# Altium schematic sheet vesta_IO_buffering.SchDoc
size A3
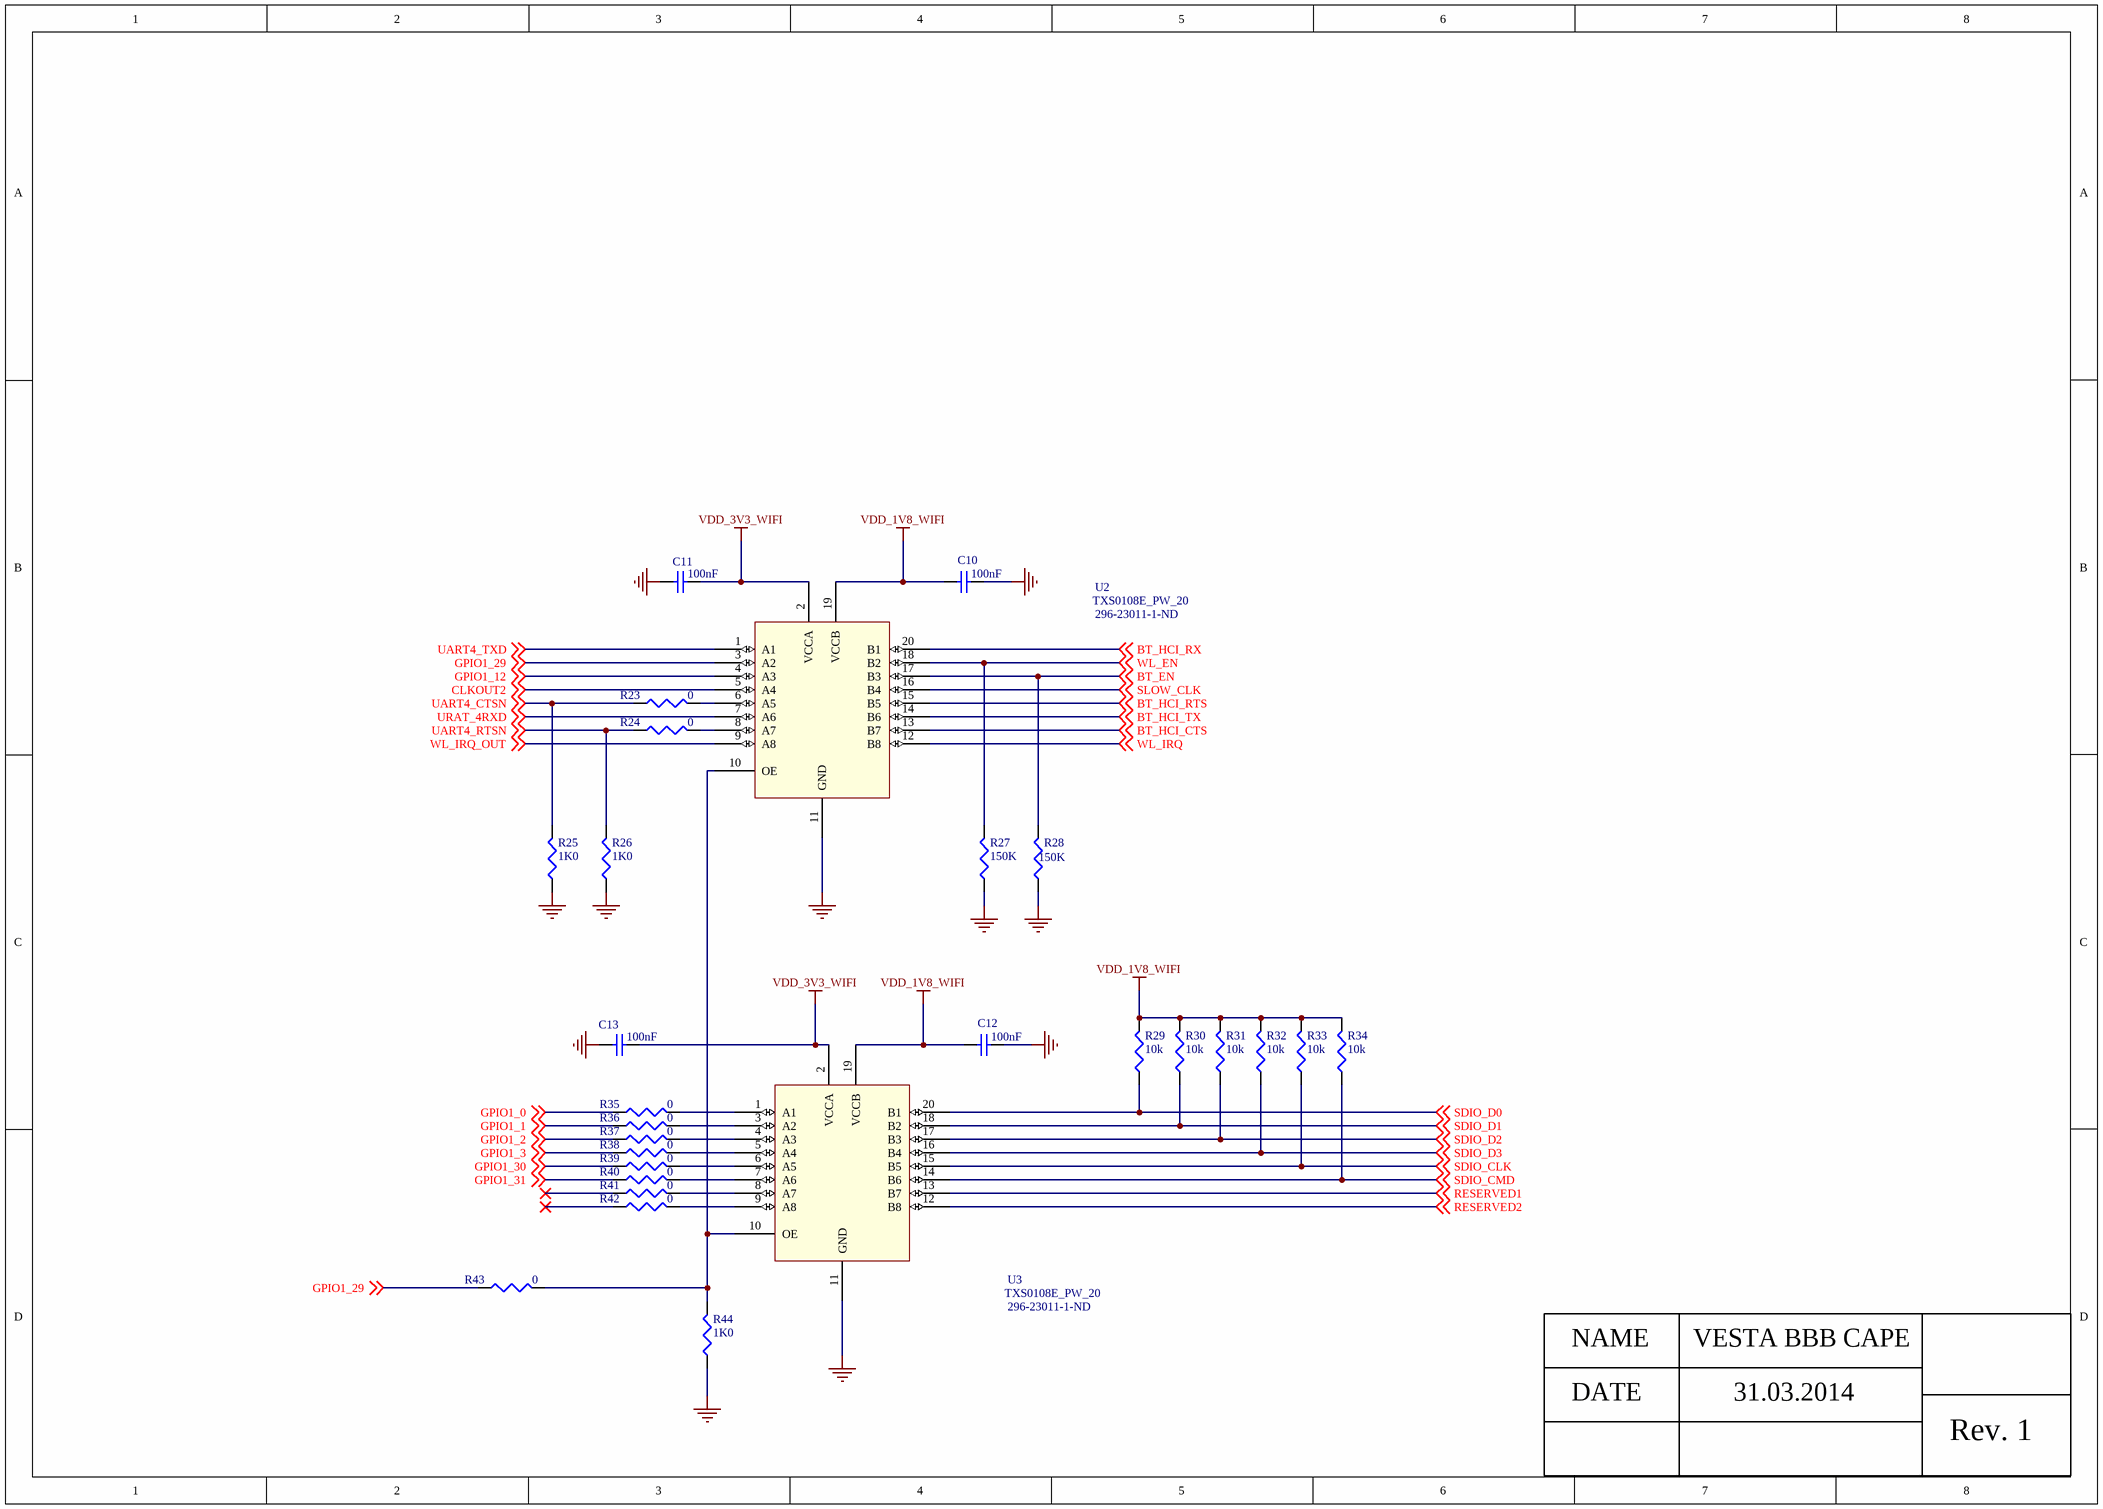
[diagram p0: vesta_IO_buffering.SchDoc]

## Parts
C10  value 100nF  [C2512]  (hidden comment: Cap Semi)
C11  value 100nF  [C2512]  (hidden comment: Cap Semi)
C12  100nF  [C2512]
C13  100nF  [C2512]
R23  0  [J1-0603]
R24  0  [J1-0603]
R25  1K0  [J1-0603]
R26  1K0  [J1-0603]
R27  150K  [J1-0603]
R28  150K  [J1-0603]
R29  10k  [J1-0603]
R30  10k  [J1-0603]
R31  10k  [J1-0603]
R32  10k  [J1-0603]
R33  10k  [J1-0603]
R34  10k  [J1-0603]
R35  0  [J1-0603]
R36  0  [J1-0603]
R37  0  [J1-0603]
R38  0  [J1-0603]
R39  0  [J1-0603]
R40  0  [J1-0603]
R41  0  [J1-0603]
R42  0  [J1-0603]
R43  0  [J1-0603]
R44  1K0  [J1-0603]
U2  TXS0108E_PW_20  Supplier Part Number 1: 296-23011-1-ND  [PW20]
U3  TXS0108E_PW_20  Supplier Part Number 1: 296-23011-1-ND  [PW20]

## Nets
GND: C10.2 C11.1 C12.2 C13.1 R25.1 R26.1 R27.1 R28.1 R44.1 U2.11(GND) U3.11(GND)
VDD_1V8_WIFI: C10.1 C12.1 R29.2 R30.2 R31.2 R32.2 R33.2 R34.2 U2.19(VCCB) U3.19(VCCB)
VDD_3V3_WIFI: C11.2 C13.2 U2.2(VCCA) U3.2(VCCA)
BT_EN: R28.2 U2.17(B3) ; off-sheet BT_EN
BT_HCI_CTS: U2.13(B7) ; off-sheet BT_HCI_CTS
BT_HCI_RTS: U2.15(B5) ; off-sheet BT_HCI_RTS
BT_HCI_RX: U2.20(B1) ; off-sheet BT_HCI_RX
BT_HCI_TX: U2.14(B6) ; off-sheet BT_HCI_TX
CLKOUT2: U2.5(A4) ; off-sheet CLKOUT2
GPIO1_0: R35.1 ; off-sheet GPIO1_0
GPIO1_1: R36.1 ; off-sheet GPIO1_1
GPIO1_2: R37.1 ; off-sheet GPIO1_2
GPIO1_3: R38.1 ; off-sheet GPIO1_3
GPIO1_12: U2.4(A3) ; off-sheet GPIO1_12
GPIO1_29: R43.1 U2.3(A2) ; off-sheet GPIO1_29
GPIO1_30: R39.1 ; off-sheet GPIO1_30
GPIO1_31: R40.1 ; off-sheet GPIO1_31
RESERVED1: U3.13(B7) ; off-sheet RESERVED1
RESERVED2: U3.12(B8) ; off-sheet RESERVED2
SDIO_CLK: R33.1 U3.15(B5) ; off-sheet SDIO_CLK
SDIO_CMD: R34.1 U3.14(B6) ; off-sheet SDIO_CMD
SDIO_D0: R29.1 U3.20(B1) ; off-sheet SDIO_D0
SDIO_D1: R30.1 U3.18(B2) ; off-sheet SDIO_D1
SDIO_D2: R31.1 U3.17(B3) ; off-sheet SDIO_D2
SDIO_D3: R32.1 U3.16(B4) ; off-sheet SDIO_D3
SLOW_CLK: U2.16(B4) ; off-sheet SLOW_CLK
UART4_CTSN: R23.1 R25.2 ; off-sheet UART4_CTSN
UART4_RTSN: R24.1 R26.2 ; off-sheet UART4_RTSN
UART4_TXD: U2.1(A1) ; off-sheet UART4_TXD
URAT_4RXD: U2.7(A6) ; off-sheet URAT_4RXD
WL_EN: R27.2 U2.18(B2) ; off-sheet WL_EN
WL_IRQ: U2.12(B8) ; off-sheet WL_IRQ
WL_IRQ_OUT: U2.9(A8) ; off-sheet WL_IRQ_OUT
NetR23_2: R23.2 U2.6(A5)
NetR24_2: R24.2 U2.8(A7)
NetR35_2: R35.2 U3.1(A1)
NetR36_2: R36.2 U3.3(A2)
NetR37_2: R37.2 U3.4(A3)
NetR38_2: R38.2 U3.5(A4)
NetR39_2: R39.2 U3.6(A5)
NetR40_2: R40.2 U3.7(A6)
NetR41_2: R41.2 U3.8(A7)
NetR42_2: R42.2 U3.9(A8)
NetR43_2: R43.2 R44.2 U2.10(OE) U3.10(OE)

Not connected (* = marked no-connect by the designer): R41 1*; R42 1*

## Notes on the sheet
- NAME
- VESTA BBB CAPE
- DATE
- 31.03.2014
- Rev. 1

## Library data of the parts
C10-C13 = Cap Semi: Capacitor (Semiconductor SIM Model); Published: 8-Jun-2000; LatestRevisionDate: 29-May-2009; LatestRevisionNote: IPC-7351 Footprint Added.; PackageReference: C1206; Publisher: Altium Limited; PackageDescription: Chip Capacitor
  C12 C13: Value: 100nF
R23-R28 R35-R44 = Res3: Resistor; Value: 1K; Published: 8-Jun-2000; LatestRevisionDate: 29-May-2009; LatestRevisionNote: IPC-7351 Footprint Added.; PackageReference: J1-0603; Publisher: Altium Limited; PackageDescription: Chip Resistor
R29-R34 = Res3: Resistor; Published: 8-Jun-2000; LatestRevisionDate: 29-May-2009; LatestRevisionNote: IPC-7351 Footprint Added.; PackageReference: J1-0603; Publisher: Altium Limited; PackageDescription: Chip Resistor; Value: 10K
U2 U3 = TXS0108E_PW_20: Imported; Vendor: Texas Instruments; PACKAGE_DESIGNATOR: PW; PIN_COUNT: 20; FAMILY_NAME: AUTO DIRECTION SENSING DUAL SUPPLY TRANSLATOR; INDUSTRY_STD_PKG_TYPE: TSSOP; Manufacturer_Part_Number: txs0108e_pw_20; GENERIC_PART_NUMBER: TXS0108E; Datasheet URL: http://www.ti.com/lit/gpn/TXB0108; Manufacturer: Texas Instruments; RefDes: RefDes; Type: DEV; Value: Value; Supplier 1: Digi-Key